# Altium schematic sheet STM32F413VGT6.SchDoc
size A3; PageSetup: Record=PageOptions|CenterHorizontal=True|CenterVertical=True|PrintScale=0.70|XCorrection=1.00|YCorrection=1.00|PrintKind=1|BorderSize=5000000|LeftOffset=0|BottomOffset=0|Orientation=2|PaperLength=1000|PaperWidth=1000|Scale=100|PaperSource=7|PrintQuality=600|MediaType=1|DitherType=10|PrintScaleMode=1|PaperKind=Letter|PaperIndex=1
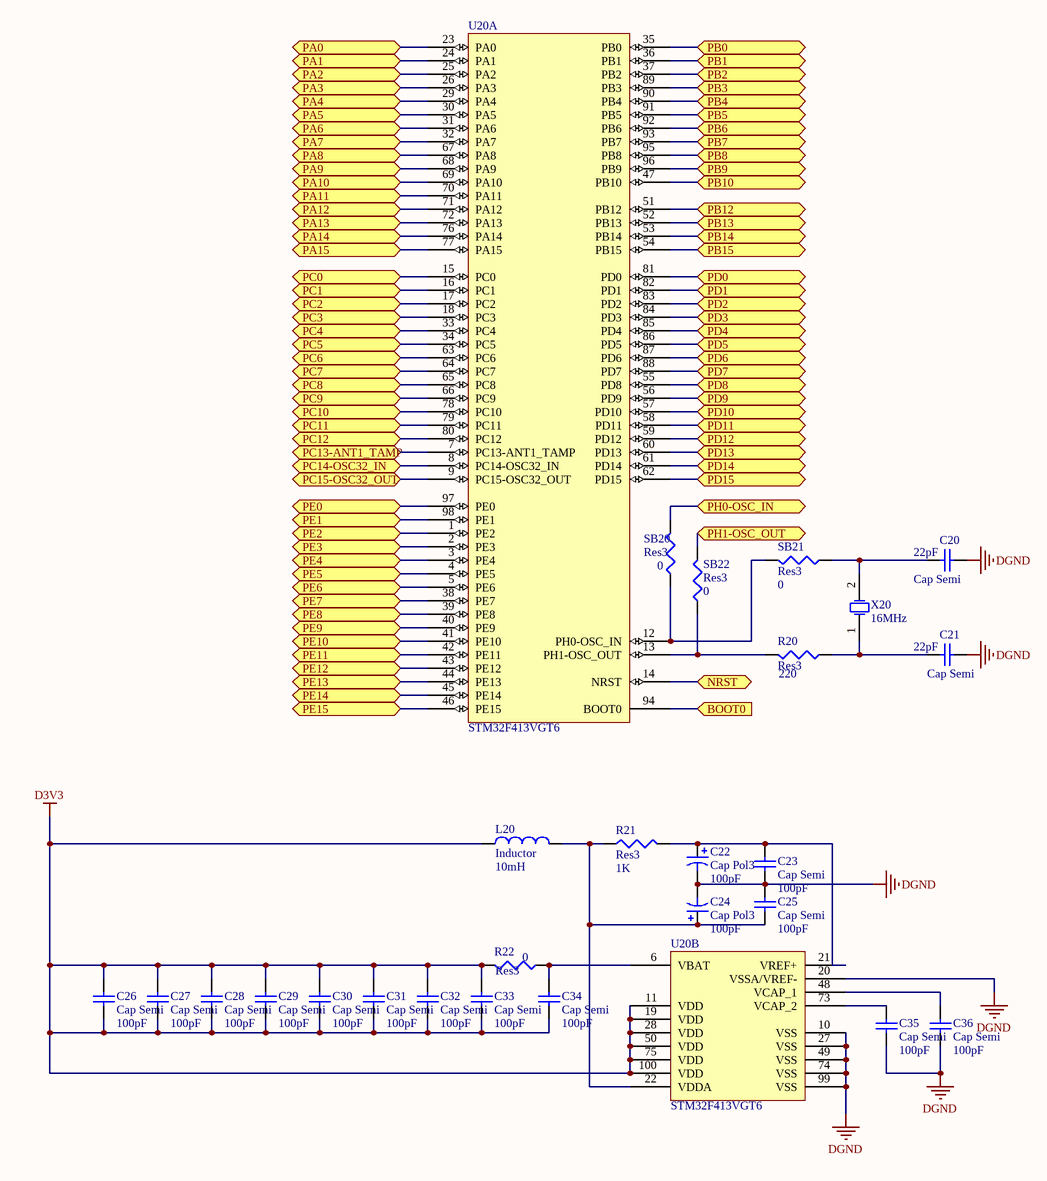
[diagram p0: STM32F413VGT6.SchDoc]

## Parts
(Parts that share a designator on the sheet are numbered #1, #2 ... from top to bottom, then left to right.)
C20  Cap Semi  value 22pF  [1608[0603]]
C21  Cap Semi  value 22pF  [1608[0603]]
C22  Cap Pol3  value 100pF  [C0805]
C23  Cap Semi  value 100pF  [1608[0603]]
C24  Cap Pol3  value 100pF  [C0805]
C25  Cap Semi  value 100pF  [1608[0603]]
C26  Cap Semi  value 100pF  [1608[0603]]
C27  Cap Semi  value 100pF  [1608[0603]]
C28  Cap Semi  value 100pF  [1608[0603]]
C29  Cap Semi  value 100pF  [1608[0603]]
C30  Cap Semi  value 100pF  [1608[0603]]
C31  Cap Semi  value 100pF  [1608[0603]]
C32  Cap Semi  value 100pF  [1608[0603]]
C33  Cap Semi  value 100pF  [1608[0603]]
C34  Cap Semi  value 100pF  [1608[0603]]
C35  Cap Semi  value 100pF  [1608[0603]]
C36  Cap Semi  value 100pF  [1608[0603]]
L20  Inductor  value 10mH  [0603]
R20  Res3  value 220  [J1-0603]
R21  Res3  value 1K  [J1-0603]
R22  Res3  value 0  [J1-0603]
SB20  Res3  value 0  [J1-0603]
SB21  Res3  value 0  [J1-0603]
SB22  Res3  value 0  [J1-0603]
U20#1  STM32F413VGT6  [STM-LQFP100_V]  (part A of 2)
U20#2  STM32F413VGT6  [STM-LQFP100_V]  (part B of 2)
X20  16MHz  [R38]

## Ports
BOOT0, NRST (bidir), PA0 (bidir), PA1 (bidir), PA2 (bidir), PA3 (bidir), PA4 (bidir), PA5 (bidir), PA6 (bidir), PA7 (bidir), PA8 (bidir), PA9 (bidir), PA10 (bidir), PA11 (bidir), PA12 (bidir), PA13 (bidir), PA14 (bidir), PA15 (bidir), PB0 (bidir), PB1 (bidir), PB2 (bidir), PB3 (bidir), PB4 (bidir), PB5 (bidir), PB6 (bidir), PB7 (bidir), PB8 (bidir), PB9 (bidir), PB10 (bidir), PB12 (bidir), PB13 (bidir), PB14 (bidir), PB15 (bidir), PC0 (bidir), PC1 (bidir), PC2 (bidir), PC3 (bidir), PC4 (bidir), PC5 (bidir), PC6 (bidir), PC7 (bidir), PC8 (bidir), PC9 (bidir), PC10 (bidir), PC11 (bidir), PC12 (bidir), PC13-ANT1_TAMP (bidir), PC14-OSC32_IN (bidir), PC15-OSC32_OUT (bidir), PD0 (bidir), PD1 (bidir), PD2 (bidir), PD3 (bidir), PD4 (bidir), PD5 (bidir), PD6 (bidir), PD7 (bidir), PD8 (bidir), PD9 (bidir), PD10 (bidir), PD11 (bidir), PD12 (bidir), PD13 (bidir), PD14 (bidir), PD15 (bidir), PE0 (bidir), PE1 (bidir), PE2 (bidir), PE3 (bidir), PE4 (bidir), PE5 (bidir), PE6 (bidir), PE7 (bidir), PE8 (bidir), PE9 (bidir), PE10 (bidir), PE11 (bidir), PE12 (bidir), PE13 (bidir), PE14 (bidir), PE15 (bidir), PH0-OSC_IN (bidir), PH1-OSC_OUT (bidir)

## Nets
D3V3: C26.1 C26.2 C27.1 C27.2 C28.1 C28.2 C29.1 C29.2 C30.1 C30.2 C31.1 C31.2 C32.1 C32.2 C33.1 C33.2 C34.1 L20.1 R22.2 U20#2.11(VDD) U20#2.19(VDD) U20#2.28(VDD) U20#2.50(VDD) U20#2.75(VDD) U20#2.100(VDD)
DGND: C20.2 C21.2 C22.2 C23.1 C24.2 C25.2 C35.1 C36.1 U20#2.10(VSS) U20#2.20(VSSA/VREF-) U20#2.27(VSS) U20#2.49(VSS) U20#2.74(VSS) U20#2.99(VSS)
BOOT0: U20#1.94(BOOT0) ; port BOOT0
NRST: U20#1.14(NRST) ; port NRST
PA0: U20#1.23(PA0) ; port PA0
PA1: U20#1.24(PA1) ; port PA1
PA2: U20#1.25(PA2) ; port PA2
PA3: U20#1.26(PA3) ; port PA3
PA4: U20#1.29(PA4) ; port PA4
PA5: U20#1.30(PA5) ; port PA5
PA6: U20#1.31(PA6) ; port PA6
PA7: U20#1.32(PA7) ; port PA7
PA8: U20#1.67(PA8) ; port PA8
PA9: U20#1.68(PA9) ; port PA9
PA10: U20#1.69(PA10) ; port PA10
PA11: U20#1.70(PA11) ; port PA11
PA12: U20#1.71(PA12) ; port PA12
PA13: U20#1.72(PA13) ; port PA13
PA14: U20#1.76(PA14) ; port PA14
PA15: U20#1.77(PA15) ; port PA15
PB0: U20#1.35(PB0) ; port PB0
PB1: U20#1.36(PB1) ; port PB1
PB2: U20#1.37(PB2) ; port PB2
PB3: U20#1.89(PB3) ; port PB3
PB4: U20#1.90(PB4) ; port PB4
PB5: U20#1.91(PB5) ; port PB5
PB6: U20#1.92(PB6) ; port PB6
PB7: U20#1.93(PB7) ; port PB7
PB8: U20#1.95(PB8) ; port PB8
PB9: U20#1.96(PB9) ; port PB9
PB10: U20#1.47(PB10) ; port PB10
PB12: U20#1.51(PB12) ; port PB12
PB13: U20#1.52(PB13) ; port PB13
PB14: U20#1.53(PB14) ; port PB14
PB15: U20#1.54(PB15) ; port PB15
PC0: U20#1.15(PC0) ; port PC0
PC1: U20#1.16(PC1) ; port PC1
PC2: U20#1.17(PC2) ; port PC2
PC3: U20#1.18(PC3) ; port PC3
PC4: U20#1.33(PC4) ; port PC4
PC5: U20#1.34(PC5) ; port PC5
PC6: U20#1.63(PC6) ; port PC6
PC7: U20#1.64(PC7) ; port PC7
PC8: U20#1.65(PC8) ; port PC8
PC9: U20#1.66(PC9) ; port PC9
PC10: U20#1.78(PC10) ; port PC10
PC11: U20#1.79(PC11) ; port PC11
PC12: U20#1.80(PC12) ; port PC12
PC13-ANT1_TAMP: U20#1.7(PC13-ANT1_TAMP) ; port PC13-ANT1_TAMP
PC14-OSC32_IN: U20#1.8(PC14-OSC32_IN) ; port PC14-OSC32_IN
PC15-OSC32_OUT: U20#1.9(PC15-OSC32_OUT) ; port PC15-OSC32_OUT
PD0: U20#1.81(PD0) ; port PD0
PD1: U20#1.82(PD1) ; port PD1
PD2: U20#1.83(PD2) ; port PD2
PD3: U20#1.84(PD3) ; port PD3
PD4: U20#1.85(PD4) ; port PD4
PD5: U20#1.86(PD5) ; port PD5
PD6: U20#1.87(PD6) ; port PD6
PD7: U20#1.88(PD7) ; port PD7
PD8: U20#1.55(PD8) ; port PD8
PD9: U20#1.56(PD9) ; port PD9
PD10: U20#1.57(PD10) ; port PD10
PD11: U20#1.58(PD11) ; port PD11
PD12: U20#1.59(PD12) ; port PD12
PD13: U20#1.60(PD13) ; port PD13
PD14: U20#1.61(PD14) ; port PD14
PD15: U20#1.62(PD15) ; port PD15
PE0: U20#1.97(PE0) ; port PE0
PE1: U20#1.98(PE1) ; port PE1
PE2: U20#1.1(PE2) ; port PE2
PE3: U20#1.2(PE3) ; port PE3
PE4: U20#1.3(PE4) ; port PE4
PE5: U20#1.4(PE5) ; port PE5
PE6: U20#1.5(PE6) ; port PE6
PE7: U20#1.38(PE7) ; port PE7
PE8: U20#1.39(PE8) ; port PE8
PE9: U20#1.40(PE9) ; port PE9
PE10: U20#1.41(PE10) ; port PE10
PE11: U20#1.42(PE11) ; port PE11
PE12: U20#1.43(PE12) ; port PE12
PE13: U20#1.44(PE13) ; port PE13
PE14: U20#1.45(PE14) ; port PE14
PE15: U20#1.46(PE15) ; port PE15
PH0-OSC_IN: SB20.2 ; port PH0-OSC_IN
PH1-OSC_OUT: SB22.2 ; port PH1-OSC_OUT
NetC20_1: C20.1 SB21.1 X20.2(OSC2)
NetC21_1: C21.1 R20.1 X20.1(OSC1)
NetC22_1: C22.1 C23.2 R21.2 U20#2.21(VREF+)
NetC24_1: C24.1 C25.1 L20.2 R21.1 U20#2.22(VDDA)
NetC34_2: C34.2 R22.1 U20#2.6(VBAT)
NetC35_2: C35.2 U20#2.73(VCAP_2)
NetC36_2: C36.2 U20#2.48(VCAP_1)
NetR20_2: R20.2 SB22.1 U20#1.13(PH1-OSC_OUT)
NetSB20_1: SB20.1 SB21.2 U20#1.12(PH0-OSC_IN)

## Library data of the parts
C20 C21 C23 C25-C36 = Cap Semi: Capacitor (Semiconductor SIM Model); Published: 8-Jun-2000; LatestRevisionDate: 29-May-2009; LatestRevisionNote: IPC-7351 Footprint Added.; PackageReference: C1206; Publisher: Altium Limited; PackageDescription: Chip Capacitor
C22 C24 = Cap Pol3: Polarized Capacitor (Surface Mount); Published: 8-Jun-2000; LatestRevisionDate: 29-May-2009; LatestRevisionNote: IPC-7351 Footprint Added.; PackageReference: C0805; Publisher: Altium Limited; PackageDescription: Chip Capacitor
L20 = Inductor: Code_IEC: 1005; Published: 8-Jun-2000; LatestRevisionDate: 29-May-2009; LatestRevisionNote: IPC-7351 Footprint Added.; PackageReference: 0402-A; Publisher: Altium Limited; PackageDescription: Chip Inductor; Code_JEITA: 0402
R20-R22 SB21 = Res3: Resistor; Published: 8-Jun-2000; LatestRevisionDate: 29-May-2009; LatestRevisionNote: IPC-7351 Footprint Added.; PackageReference: J1-0603; Publisher: Altium Limited; PackageDescription: Chip Resistor
SB20 = Res3: SB PH0; Published: 8-Jun-2000; LatestRevisionDate: 29-May-2009; LatestRevisionNote: IPC-7351 Footprint Added.; PackageReference: J1-0603; Publisher: Altium Limited; PackageDescription: Chip Resistor
SB22 = Res3: SB_PH1; Published: 8-Jun-2000; LatestRevisionDate: 29-May-2009; LatestRevisionNote: IPC-7351 Footprint Added.; PackageReference: J1-0603; Publisher: Altium Limited; PackageDescription: Chip Resistor
U20#1 U20#2 = CMP-1771-00004-1: ARM Cortex-M4 32-Bit DSP+FPU, 1024 KB Flash, 82 I/Os, 100-Pin LQFP, -40 to 85 degC, Tray; ComponentLink1URL: http://www.st.com/; PackageDescription: 100-Pin Low Profile Quad Flat Package, Body 14 x 14 mm, Pitch 0.5 mm; Mounting Technology: Surface Mount; PackageReference: LQFP100; ComponentLink1Description: Manufacturer URL; DatasheetVersion: Rev. 1; PartId: 1
X20 = XTAL: Crystal Oscillator; Published: 8-Jun-2000; LatestRevisionDate: 17-Jul-2002; LatestRevisionNote: Re-released for DXP Platform.; PackageReference: R38; Publisher: Altium Limited; PackageDescription: Crystal, Thru-Hole; 2 Leads; Body 3.1 x 8.2 mm (Dia.xH)